# Altium schematic sheet COVER PAGE.SchDoc: Do not fill
size 393 x 281 mm; Date: Do not fill; CompanyName: STAR; DrawnBy: Do not fill; Engineer: Do not fill; Organization: STAR; Address1: Avenida Peseta 68, 1ºB; Address2: Madrid, Madrid 28054; Address3: +34603739927; Address4: contact.star@uc3m.es; DocumentNumber: Do not fill; SheetNumber: 1; SheetTotal: 3; Project Name: Purple Pill; Sheet Name: Cover Page; Web Page: STARuc3m.com; DateStarted: 20/11/2022; Time: Do not fill; ImagePath: Do not fill; Application_BuildNumber: Do not fill
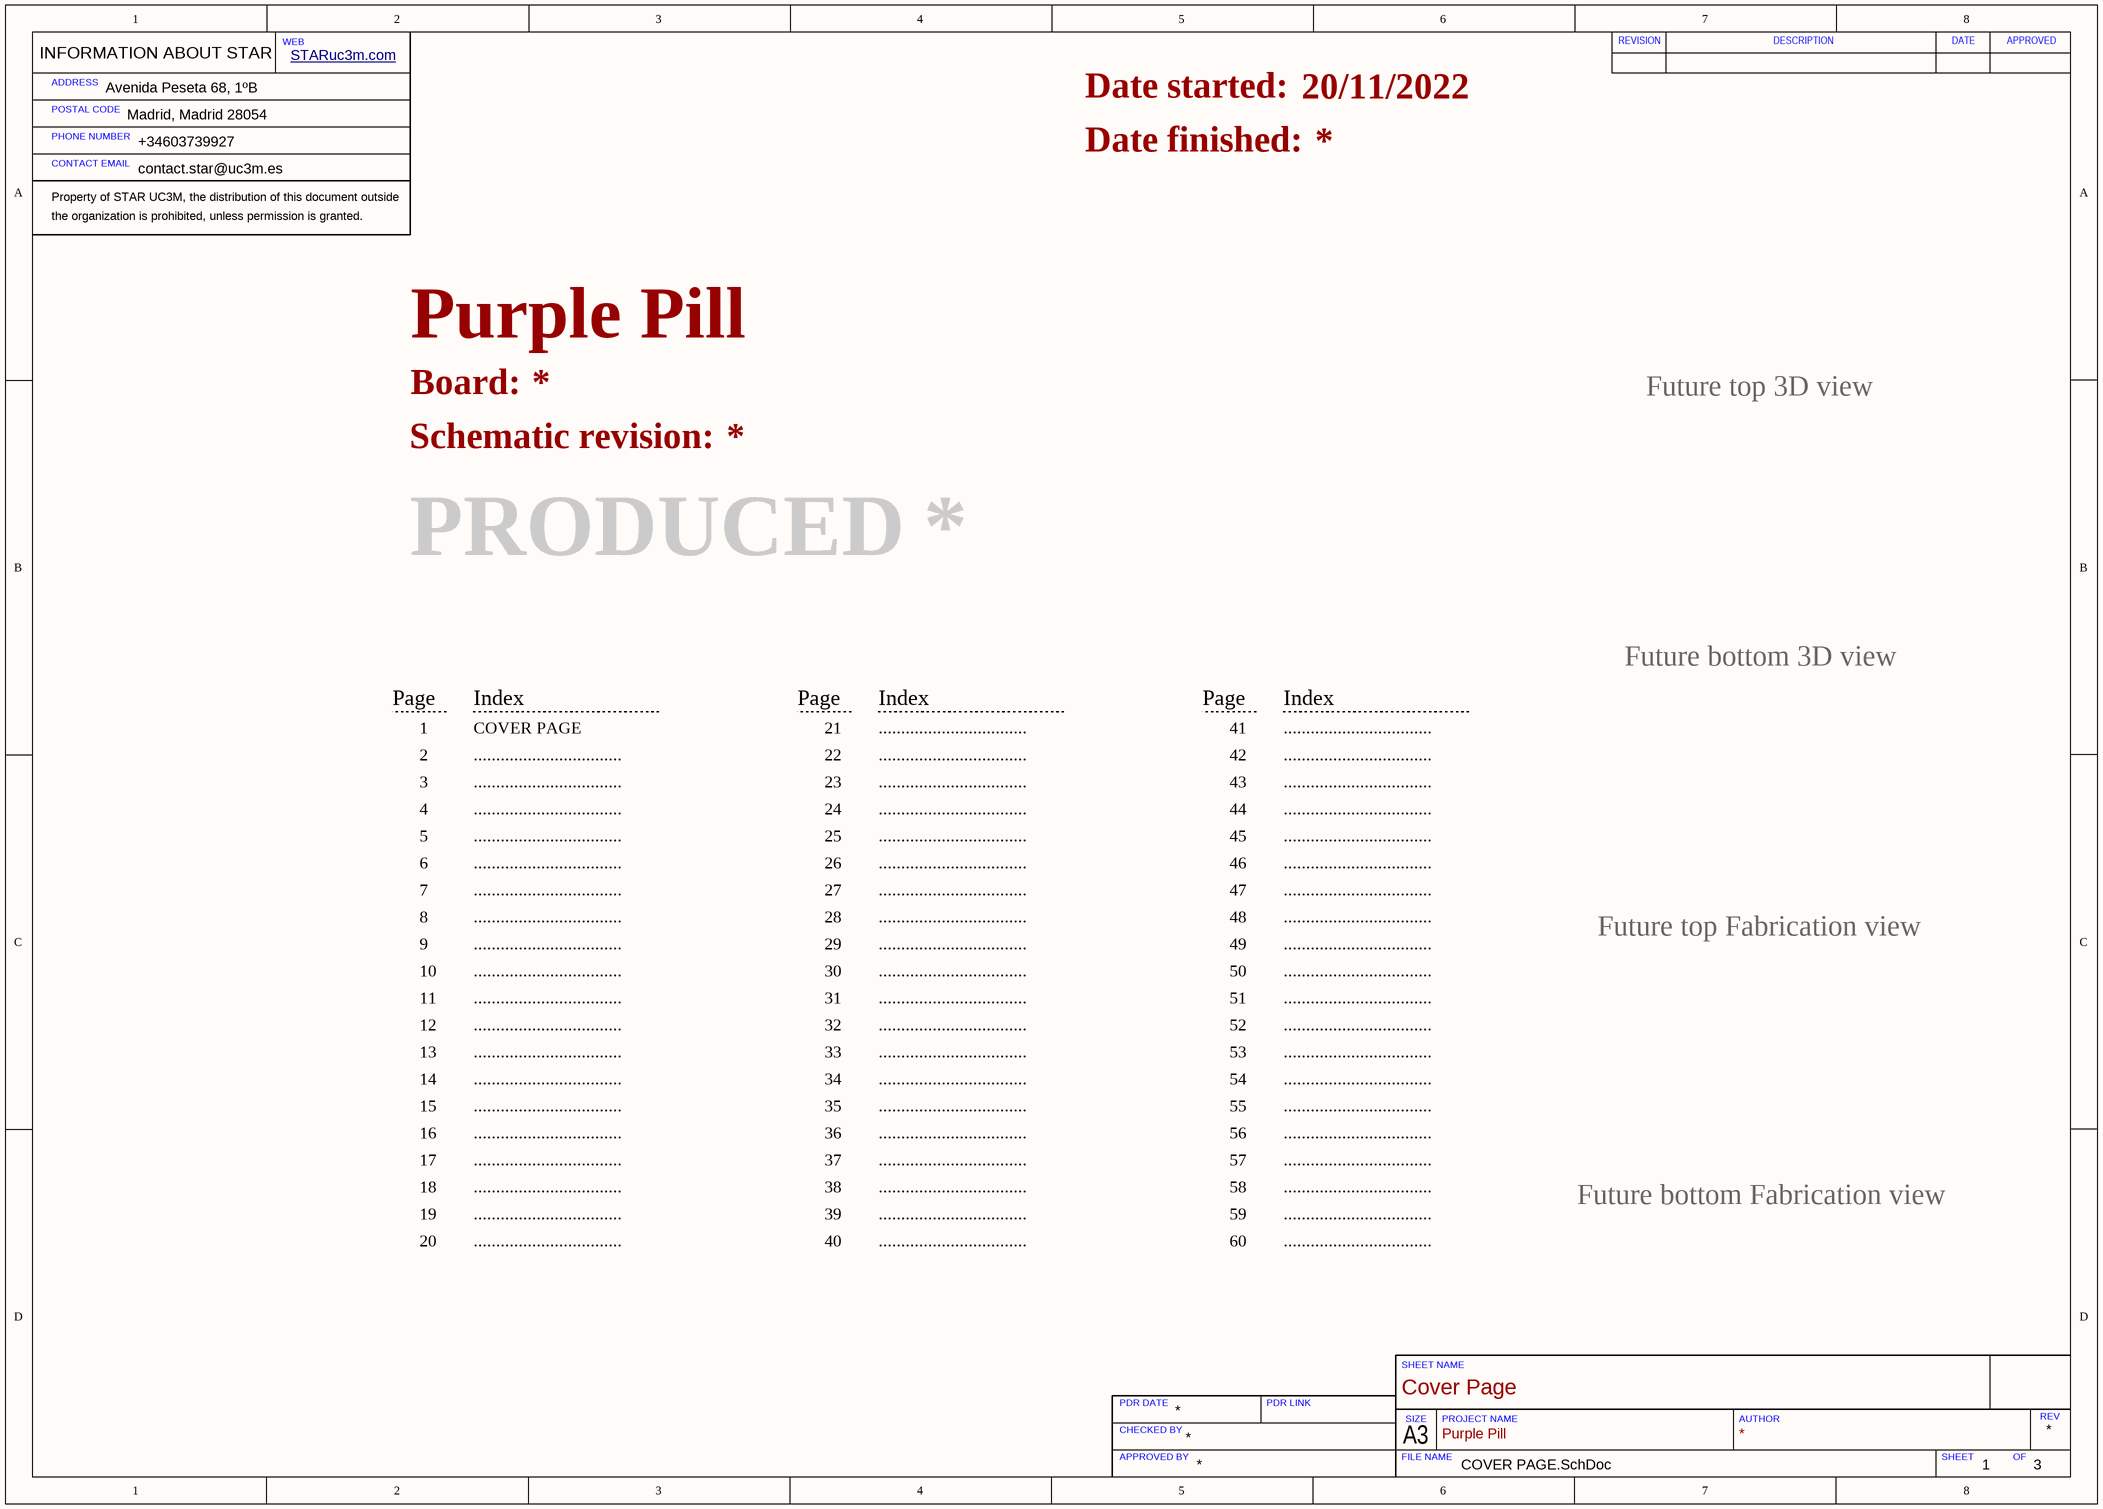
[diagram p0: COVER PAGE.SchDoc]

## Notes on the sheet
- Date started:
- Date finished:
- Schematic revision:
- Board:
- Future top 3D view
- PRODUCED
- Page
- Index
- Future bottom 3D view
- 1
- 2
- 3
- COVER PAGE
- .................................
- 21
- 22
- 23
- 41
- 42
- 43
- 4
- 5
- 24
- 25
- 44
- 45
- 6
- 7
- 8
- 26
- 27
- 28
- 46
- 47
- 48
- 9
- 10
- 29
- 30
- 49
- 50
- Future top Fabrication view
- 11
- 12
- 13
- 31
- 32
- 33
- 51
- 52
- 53
- 14
- 15
- 34
- 35
- 54
- 55
- 16
- 17
- 18
- 36
- 37
- 38
- 56
- 57
- 58
- 19
- 20
- 39
- 40
- 59
- 60
- Future bottom Fabrication view
- INFORMATION ABOUT STAR
- WEB
- REVISION
- DESCRIPTION
- DATE
- APPROVED
- ADDRESS
- POSTAL CODE
- PHONE NUMBER
- CONTACT EMAIL
- Property of STAR UC3M, the distribution of this document outside
- the organization is prohibited, unless permission is granted.
- PDR DATE
- PDR LINK
- SHEET NAME
- APPROVED BY
- CHECKED BY
- FILE NAME
- A3
- SIZE
- PROJECT NAME
- AUTHOR
- SHEET
- OF
- REV